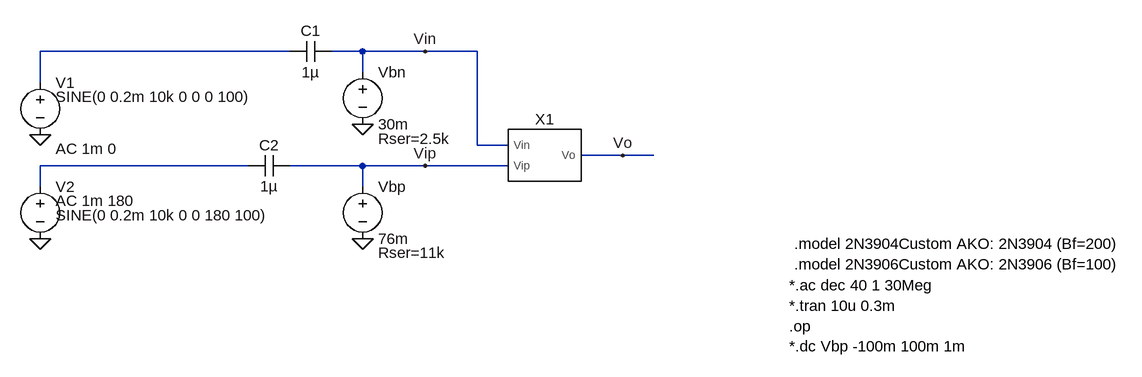
[diagram p0: schematic open_loop.asc]
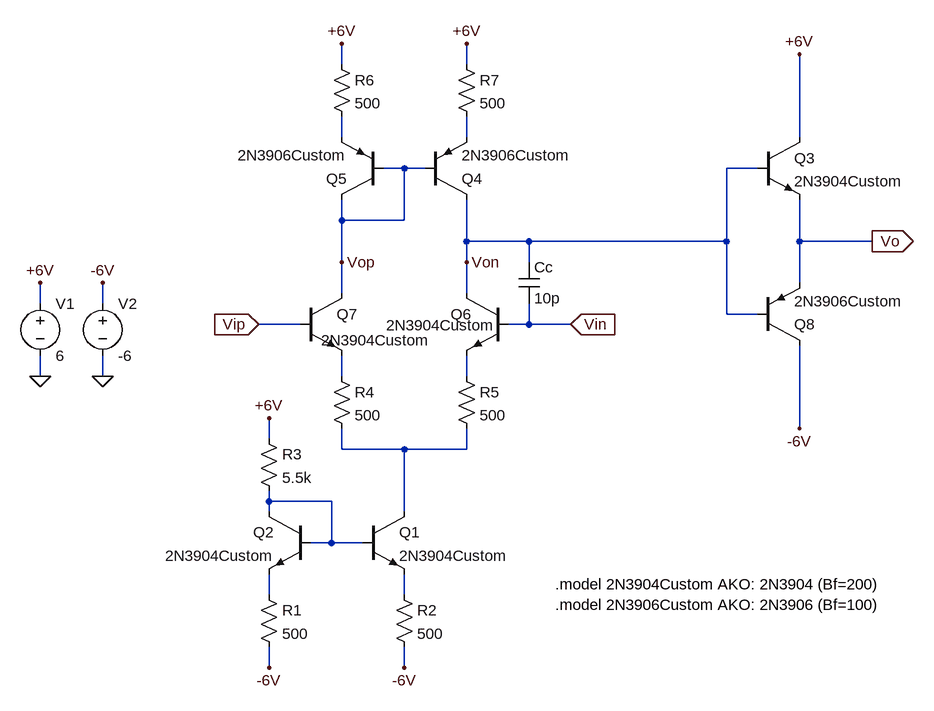
[diagram p1: sub-circuit base.asc]
open_loop.asc, the LTspice schematic file:
Version 4
SHEET 1 1292 680
WIRE 0 144 -384 144
WIRE 112 144 64 144
WIRE 208 144 112 144
WIRE 288 144 208 144
WIRE 112 176 112 144
WIRE -384 192 -384 144
WIRE 288 288 288 144
WIRE 336 288 288 288
WIRE 512 304 448 304
WIRE 560 304 512 304
WIRE -64 320 -384 320
WIRE 112 320 0 320
WIRE 208 320 112 320
WIRE 336 320 208 320
WIRE -384 352 -384 320
WIRE 112 352 112 320
FLAG -384 432 0
FLAG -384 272 0
FLAG 208 320 Vip
FLAG 208 144 Vin
FLAG 512 304 Vo
FLAG 112 256 0
FLAG 112 432 0
SYMBOL base 384 304 R0
SYMATTR InstName X1
SYMBOL Voltage -384 176 R0
WINDOW 123 24 118 Left 2
WINDOW 3 24 38 Left 2
SYMATTR Value2 AC 1m 0
SYMATTR Value SINE(0 0.2m 10k 0 0 0 100)
SYMATTR InstName V1
SYMBOL Voltage -384 336 R0
WINDOW 123 24 38 Left 2
WINDOW 3 24 60 Left 2
SYMATTR Value2 AC 1m 180
SYMATTR Value SINE(0 0.2m 10k 0 0 180 100)
SYMATTR InstName V2
SYMBOL Cap 64 128 R90
WINDOW 0 0 32 VBottom 2
WINDOW 3 32 32 VTop 2
SYMATTR InstName C1
SYMATTR Value 1µ
SYMBOL Cap 0 304 R90
WINDOW 0 0 32 VBottom 2
WINDOW 3 32 32 VTop 2
SYMATTR InstName C2
SYMATTR Value 1µ
SYMBOL Voltage 112 160 R0
WINDOW 39 24 118 Left 2
SYMATTR SpiceLine Rser=2.5k
SYMATTR InstName Vbn
SYMATTR Value 30m
SYMBOL Voltage 112 336 R0
WINDOW 39 24 118 Left 2
SYMATTR SpiceLine Rser=11k
SYMATTR InstName Vbp
SYMATTR Value 76m
TEXT 776 440 Left 2 !.model 2N3904Custom AKO: 2N3904 (Bf=200)\n.model 2N3906Custom AKO: 2N3906 (Bf=100)
TEXT 768 504 Left 2 !*.ac dec 40 1 30Meg\n*.tran 10u 0.3m\n.op\n*.dc Vbp -100m 100m 1m

base.asc, the sub-circuit schematic file:
Version 4
SHEET 1 2084 764
WIRE 432 -240 432 -272
WIRE 624 -240 624 -272
WIRE 432 -128 432 -160
WIRE 624 -128 624 -160
WIRE 1136 -128 1136 -256
WIRE 528 -80 496 -80
WIRE 560 -80 528 -80
WIRE 1072 -80 1024 -80
WIRE 432 0 432 -32
WIRE 528 0 528 -80
WIRE 528 0 432 0
WIRE 624 32 624 -32
WIRE 720 32 624 32
WIRE 1024 32 1024 -80
WIRE 1024 32 720 32
WIRE 1136 32 1136 -32
WIRE 1248 32 1136 32
WIRE 432 64 432 0
WIRE 624 64 624 32
WIRE 720 64 720 32
WIRE 1136 96 1136 32
WIRE 432 112 432 64
WIRE 624 112 624 64
WIRE -32 128 -32 96
WIRE 64 128 64 96
WIRE 1024 144 1024 32
WIRE 1072 144 1024 144
WIRE 368 160 304 160
WIRE 720 160 720 128
WIRE 720 160 688 160
WIRE 784 160 720 160
WIRE -32 240 -32 208
WIRE 64 240 64 208
WIRE 432 240 432 208
WIRE 624 240 624 208
WIRE 1136 320 1136 192
WIRE 320 336 320 304
WIRE 432 352 432 320
WIRE 528 352 432 352
WIRE 624 352 624 320
WIRE 624 352 528 352
WIRE 320 432 320 416
WIRE 416 432 320 432
WIRE 320 448 320 432
WIRE 528 448 528 352
WIRE 416 496 416 432
WIRE 416 496 384 496
WIRE 464 496 416 496
WIRE 320 576 320 544
WIRE 528 576 528 544
WIRE 320 688 320 656
WIRE 528 688 528 656
FLAG 320 304 +6V
FLAG 320 688 -6V
FLAG 528 688 -6V
FLAG 432 -272 +6V
FLAG 624 -272 +6V
FLAG 784 160 Vin
IOPIN 784 160 In
FLAG 304 160 Vip
IOPIN 304 160 In
FLAG 1136 -256 +6V
FLAG 1136 320 -6V
FLAG -32 96 +6V
FLAG 64 96 -6V
FLAG 1248 32 Vo
IOPIN 1248 32 Out
FLAG 624 64 Von
FLAG 432 64 Vop
FLAG -32 240 0
FLAG 64 240 0
SYMBOL npn 464 448 R0
SYMATTR InstName Q1
SYMATTR Value 2N3904Custom
SYMBOL npn 384 448 M0
SYMATTR InstName Q2
SYMATTR Value 2N3904Custom
SYMBOL Res 304 560 R0
SYMATTR InstName R1
SYMATTR Value 500
SYMBOL Res 512 560 R0
SYMATTR InstName R2
SYMATTR Value 500
SYMBOL Res 304 320 R0
SYMATTR InstName R3
SYMATTR Value 5.5k
SYMBOL Res 416 224 R0
SYMATTR InstName R4
SYMATTR Value 500
SYMBOL Res 608 224 R0
SYMATTR InstName R5
SYMATTR Value 500
SYMBOL Res 416 -256 R0
SYMATTR InstName R6
SYMATTR Value 500
SYMBOL Res 608 -256 R0
SYMATTR InstName R7
SYMATTR Value 500
SYMBOL npn 1072 -128 R0
SYMATTR InstName Q3
SYMATTR Value 2N3904Custom
SYMBOL Voltage -32 112 R0
SYMATTR InstName V1
SYMATTR Value 6
SYMBOL Voltage 64 112 R0
SYMATTR InstName V2
SYMATTR Value -6
SYMBOL npn 688 112 M0
WINDOW 3 20 49 Left 2
SYMATTR Value 2N3904Custom
SYMATTR InstName Q6
SYMBOL npn 368 112 R0
WINDOW 3 32 72 Left 2
SYMATTR Value 2N3904Custom
SYMATTR InstName Q7
SYMBOL pnp 560 -32 M180
SYMATTR InstName Q4
SYMATTR Value 2N3906Custom
SYMBOL pnp 496 -32 R180
SYMATTR InstName Q5
SYMATTR Value 2N3906Custom
SYMBOL Cap 704 64 R0
SYMATTR InstName Cc
SYMATTR Value 10p
SYMBOL pnp 1072 192 M180
SYMATTR InstName Q8
SYMATTR Value 2N3906Custom
TEXT 760 560 Left 2 !.model 2N3904Custom AKO: 2N3904 (Bf=200)\n.model 2N3906Custom AKO: 2N3906 (Bf=100)

The netlist it stands for:
* open_loop.asc
XX1 Vin Vip Vo base
V1 N001 0 SINE(0 0.2m 10k 0 0 0 100) AC 1m 0
V2 N002 0 SINE(0 0.2m 10k 0 0 180 100) AC 1m 180
C1 Vin N001 1µ
C2 Vip N002 1µ
Vbn Vin 0 30m Rser=2.5k
Vbp Vip 0 76m Rser=11k

* block symbol definitions
.subckt base Vin Vip Vo
Q1 N005 N006 N008 0 2N3904Custom
Q2 N006 N006 N007 0 2N3904Custom
R1 N007 -6V 500
R2 N008 -6V 500
R3 +6V N006 5.5k
R4 N003 N005 500
R5 N004 N005 500
R6 +6V N001 500
R7 +6V N002 500
Q3 +6V Von Vo 0 2N3904Custom
V1 +6V 0 6
V2 -6V 0 -6
Q6 Von Vin N004 0 2N3904Custom
Q7 Vop Vip N003 0 2N3904Custom
Q4 Von Vop N002 0 2N3906Custom
Q5 Vop Vop N001 0 2N3906Custom
Cc Von Vin 10p
Q8 -6V Von Vo 0 2N3906Custom
.model 2N3904Custom AKO: 2N3904 (Bf=200)
.model 2N3906Custom AKO: 2N3906 (Bf=100)
.ends base

.model NPN NPN
.model PNP PNP
.lib standard.bjt
.model 2N3904Custom AKO: 2N3904 (Bf=200)
.model 2N3906Custom AKO: 2N3906 (Bf=100)
*.ac dec 40 1 30Meg
*.tran 10u 0.3m
.op
*.dc Vbp -100m 100m 1m
.backanno
.end